# Altium schematic sheet User_Interface.SchDoc
size A3; SheetNumber: 7; SheetTotal: 9
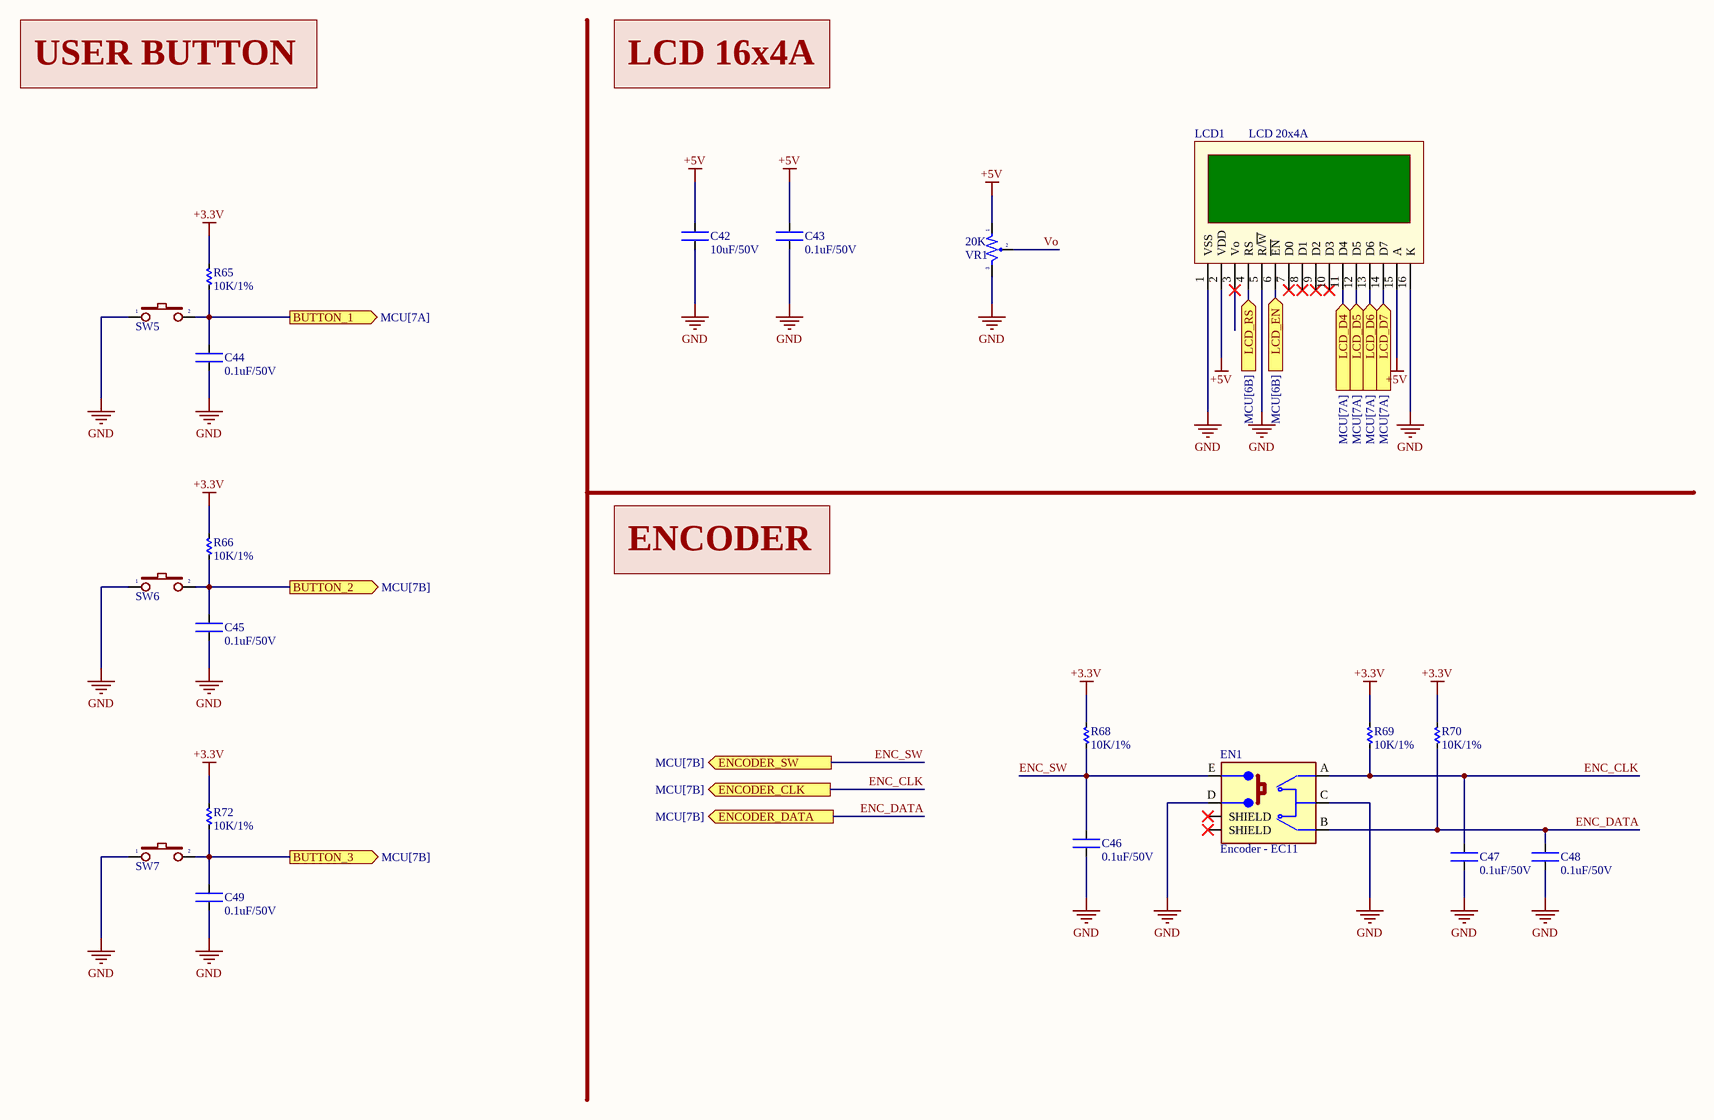
[diagram p0: User_Interface.SchDoc]

## Parts
C42  10uF/50V  [CAP - 0603]
C43  0.1uF/50V  [CAP - 0603]
C44  0.1uF/50V  [CAP - 0603]
C45  0.1uF/50V  [CAP - 0603]
C46  0.1uF/50V  [CAP - 0603]
C47  0.1uF/50V  [CAP - 0603]
C48  0.1uF/50V  [CAP - 0603]
C49  0.1uF/50V  [CAP - 0603]
EN1  Encoder - EC11  [Encoder - EC11]
LCD1  LCD 20x4A  [LCD-20x4A-4-Holes]
R65  10K/1%  [RES - 0603]
R66  10K/1%  [RES - 0603]
R68  10K/1%  [RES - 0603]
R69  10K/1%  [RES - 0603]
R70  10K/1%  [RES - 0603]
R72  10K/1%  [RES - 0603]
SW5  Button 4 Pins  [SW-SMD-6x6mm]  (value not drawn)
SW6  Button 4 Pins  [SW-SMD-6x6mm]  (value not drawn)
SW7  Button 4 Pins  [SW-SMD-6x6mm]  (value not drawn)
VR1  20K  [VR 3x3]

## Ports
BUTTON_1 (out, see MCU[7A]), BUTTON_2 (out, see MCU[7B]), BUTTON_3 (out, see MCU[7B]), ENCODER_CLK (out, see MCU[7B]), ENCODER_DATA (out, see MCU[7B]), ENCODER_SW (out, see MCU[7B]), LCD_D4 (in, see MCU[7A]), LCD_D5 (in, see MCU[7A]), LCD_D6 (in, see MCU[7A]), LCD_D7 (in, see MCU[7A]), LCD_EN (in, see MCU[6B]), LCD_RS (in, see MCU[6B])

## Nets
+3.3V: R65.2 R66.2 R68.2 R69.2 R70.2 R72.1
+5V: C42.2 C43.2 LCD1.2(VDD) LCD1.15(A) VR1.1
GND: C42.1 C43.1 C44.1 C45.1 C46.1 C47.1 C48.1 C49.1 EN1.C EN1.D(S1) LCD1.1(VSS) LCD1.5(R/~{W}) LCD1.16(K) SW5.1 SW6.1 SW7.1 VR1.3
BUTTON_1: C44.2 R65.1 SW5.2 ; port BUTTON_1
BUTTON_2: C45.2 R66.1 SW6.2 ; port BUTTON_2
BUTTON_3: C49.2 R72.2 SW7.2 ; port BUTTON_3
ENC_CLK: C47.2 EN1.A R69.1 ; port ENCODER_CLK
ENC_DATA: C48.2 EN1.B R70.1 ; port ENCODER_DATA
ENC_SW: C46.2 EN1.E(S2) R68.1 ; port ENCODER_SW
LCD_D4: LCD1.11(D4) ; port LCD_D4
LCD_D5: LCD1.12(D5) ; port LCD_D5
LCD_D6: LCD1.13(D6) ; port LCD_D6
LCD_D7: LCD1.14(D7) ; port LCD_D7
LCD_EN: LCD1.6(~{EN}) ; port LCD_EN
LCD_RS: LCD1.4(RS) ; port LCD_RS
Vo: VR1.2

Not connected (* = marked no-connect by the designer): EN1 SH1(SHIELD)* SH2(SHIELD)*; LCD1 3(Vo)* 7(D0)* 8(D1)* 9(D2)* 10(D3)*

## Notes on the sheet
- USER BUTTON
- LCD 16x4A
- ENCODER

## Library data of the parts
C42-C49 = CAPACITOR: CAPACITOR SMD - KEMET
EN1 = Encoder - EC11: Bourns PEC11R-4015F-S0024
LCD1 = LCD 20x4A: LCD 2004
R65 R66 R68-R70 R72 = RESISTOR: Resistor SMD - YAGEO
SW5-SW7 = Button 4 Pins: DIP Button 4 Pins
VR1 = VARIABLE RESISTOR: VR